# EAGLE design untitled (EAGLE 7.1.0)
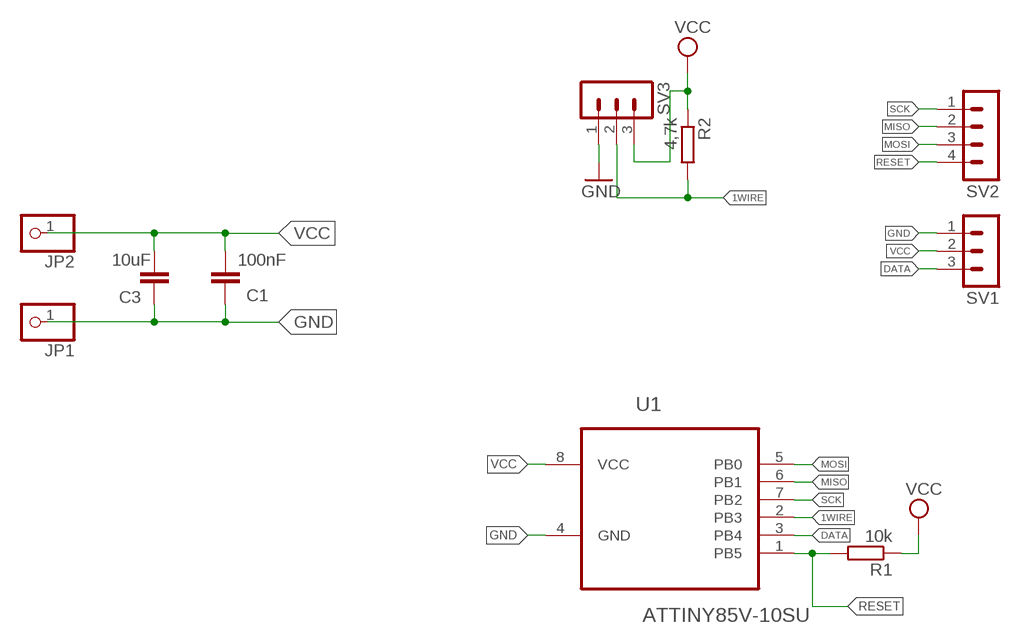
[diagram p0: schematic, sheet 1]

## Parts
C1  100nF  C-EUC0805  [C0805]
C3  10uF  C-EUC1206  [C1206]
JP1  PINHD-1X1  [1X01]
JP2  PINHD-1X1  [1X01]
R1  10k  R-EU_R0805  [R0805]
R2  4,7k  R-EU_R0805  [R0805]
SV1  MA03-1  [MA03-1]
SV2  MA04-1  [MA04-1]
SV3  MA03-1  [MA03-1]
U1  ATTINY85V-10SU  [SOIC127P798X216-8N]

## Nets
1WIRE: R2.2 SV3.2 U1.2(PB3)
DATA: SV1.3 U1.3(PB4)
GND: C1.1 C3.2 JP1.1 SV1.1 SV3.1 U1.4(GND)
MISO: SV2.2 U1.6(PB1)
MOSI: SV2.3 U1.5(PB0)
RESET: R1.2 SV2.4 U1.1(PB5)
SCK: SV2.1 U1.7(PB2)
VCC: C1.2 C3.1 JP2.1 R1.1 R2.1 SV1.2 SV3.3 U1.8(VCC)

## Library data of the parts
C1 C3 = rcl:C-EU: CAPACITOR, European symbol
JP1 JP2 = adafruit:PINHD-1X1: Pin header 1x1 for 0.1" spacing With round pins
R1 R2 = rcl:R-EU_: RESISTOR, European symbol
SV1 SV3 = con-lstb:MA03-1: PIN HEADER; OC_FARNELL: unknown; OC_NEWARK: unknown
SV2 = con-lstb:MA04-1: PIN HEADER; OC_FARNELL: unknown; OC_NEWARK: unknown
U1 = atmel:ATTINY85V-10SU: 8-bit Microcontroller with In-System Programmable Flash; MPN: ATTINY85V-10SU; OC_FARNELL: 1455166; OC_NEWARK: 58M3799; PACKAGE: SOIC-8; SUPPLIER: Atmel

## Board
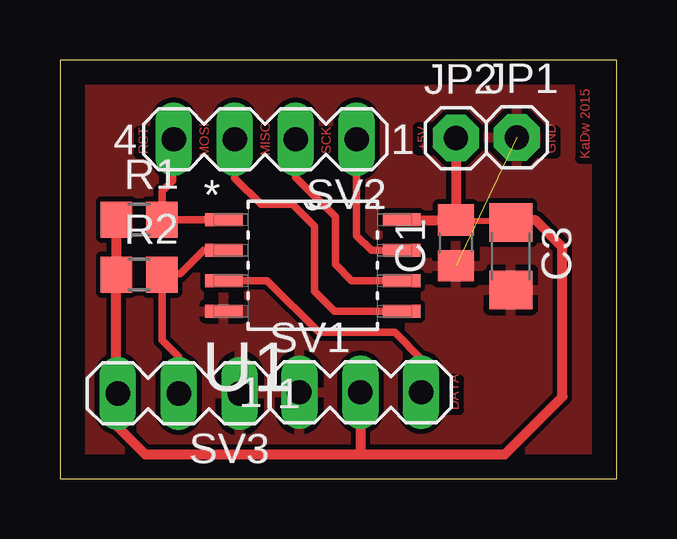
[diagram p1: board, top side]

Size 23.22 x 17.45 mm. Coordinates in mm from the lower left corner, seen from the top.
Outline: 0,0 23.22,0 23.22,17.45 0,17.45 0,0
Copper layers (1*16): Top 0.035mm / dielectric 1.5mm / Bottom 0.035mm
Design rules "default": minimum track width 10mil, minimum drill 24mil, track to track 8mil, track to pad 8mil, pad to pad 8mil, via to via 8mil, smd to smd 8mil, copper to edge 40mil, drill to drill 8mil, minimum pad ring 10mil, minimum via ring 8mil, stop-mask expansion 4mil, vias tented up to drill 0mil, thermal gap 10mil

### Footprints (pad centres in the part's own frame; a part is rotated, then mirrored left to right if it is on the bottom)
C0805 = smd 1.3 x 1.5: 1 -0.95,0; 2 0.95,0
C1206 = smd 1.6 x 1.8: 1 -1.4,0; 2 1.4,0
1X01 = drill 1.016 pad 1.93 octagon: 1 0,0
R0805 = smd 1.3 x 1.5: 1 -0.95,0; 2 0.95,0
MA03-1 = drill 1.016 long: 1 -2.54,0; 2 0,0; 3 2.54,0
MA04-1 = drill 1.016 long: 1 -3.81,0; 2 -1.27,0; 3 1.27,0; 4 3.81,0
SOIC127P798X216-8N = smd 1.549 x 0.533: 1 -3.708,1.905; 2 -3.708,0.635; 3 -3.708,-0.635; 4 -3.708,-1.905; 5 3.708,-1.905; 6 3.708,-0.635; 7 3.708,0.635; 8 3.708,1.905

### Placement (x,y rotation side)
C1  16.51,9.83 90 top
C3  18.8,9.27 270 top
JP1  19.05,14.22 0 top
JP2  16.51,14.2 0 top
R1  3.3,10.8 0 top
R2  3.3,8.51 0 top
SV1  12.52,3.61 0 top
SV2  8.56,14.15 180 top
SV3  4.95,3.56 180 top
U1  10.54,8.89 0 top

### Tracks (layer width: path | path; a pad name or v marks a point on that pad's centre or on a via)
1WIRE
  Top 0.305: U1.2 5.99,9.53 5,8.53 4.28,8.53 | SV3.2 4.95,5.08 4.25,5.78 R2.2
  Top 0.406: R2.2 4.28,8.53
DATA
  Top 0.305: U1.3 8.64,8.26 10.79,6.1 13.97,6.1 15.06,5 SV1.3
GND  (1 unrouted)
  pour Top: -0.13,17.02 24.26,17.02 24.26,-1.52 -0.13,-1.52
MISO
  Top 0.305: SV2.2 9.83,12.57 11.48,10.92 11.48,8.94 12.17,8.26 U1.6
MOSI
  Top 0.305: SV2.3 7.29,12.52 8.38,11.43 9.7,11.43 10.62,10.52 10.62,7.82 11.46,6.99 U1.5
RESET
  Top 0.305: U1.1 R1.2 4.25,11.97 4.7,12.42 4.7,14.1
  Top 0.406: SV2.4 4.7,14.1
SCK
  Top 0.305: SV2.1 12.37,10.14 12.98,9.53 U1.7
VCC
  Top 0.254: U1.8 14.3,10.74 18.8,10.74 C3.1
  Top 0.406: R1.1 R2.1 2.35,3.62 SV3.3 2.41,2.16 3.56,1.02 12.52,1.02 | U1.8 14.27,10.78 C1.2 | C1.2 | JP2.1 C1.2 | 12.52,1.02 18.54,1.02 20.95,3.43 20.95,9.65 19.84,10.77 18.8,10.77 C3.1 | SV1.2 12.52,1.02

### Text on the board
Top: +5V | RST | MOSI | MISO | SCK | GND | KaDw 2015 | DATA